# Altium schematic sheet LO.SchDoc
size A4
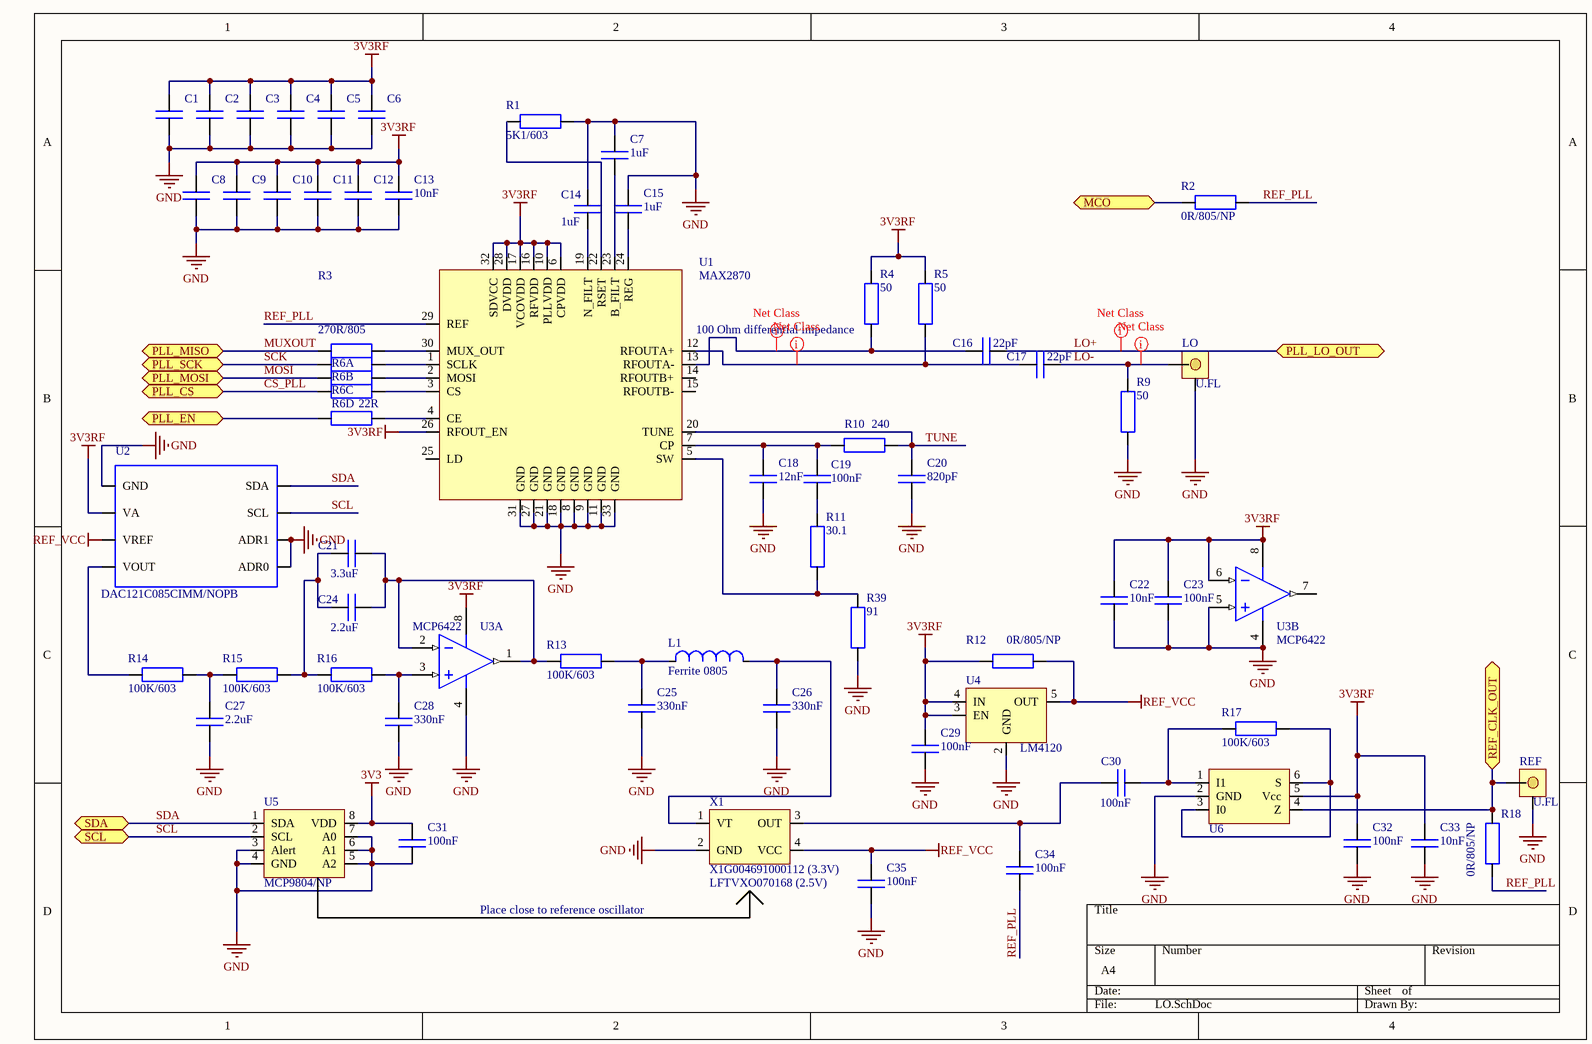
[diagram p0: LO.SchDoc]

## Parts
C1  100nF  [smd C0603_0.80]  (value not drawn)
C2  100nF  [smd C0603_0.80]  (value not drawn)
C3  100nF  [smd C0603_0.80]  (value not drawn)
C4  100nF  [smd C0603_0.80]  (value not drawn)
C5  100nF  [smd C0603_0.80]  (value not drawn)
C6  100nF  [smd C0603_0.80]  (value not drawn)
C7  1uF  [smd C0603_0.80]
C8  10nF  [smd C0402]  (value not drawn)
C9  10nF  [smd C0402]  (value not drawn)
C10  10nF  [smd C0402]  (value not drawn)
C11  10nF  [smd C0402]  (value not drawn)
C12  10nF  [smd C0402]  (value not drawn)
C13  10nF  [smd C0402]
C14  1uF  [smd C0603_0.80]
C15  1uF  [smd C0603_0.80]
C16  22pF  [smd C0402]
C17  22pF  [smd C0402]
C18  12nF  [smd C0603_0.80]
C19  100nF  [smd C0603_0.80]
C20  820pF  [smd C0603_0.80]
C21  3.3uF  [smd C0805_1.30]
C22  10nF  [smd C0402]
C23  100nF  [smd C0603_0.80]
C24  2.2uF  [smd C0805_1.30]
C25  330nF  [smd C0805_0.60]
C26  330nF  [smd C0805_0.60]
C27  2.2uF  [smd C0805_1.30]
C28  330nF  [smd C0805_0.60]
C29  100nF  [smd C0603_0.80]
C30  100nF  [smd C0603_0.80]
C31  100nF  [smd C0603_0.80]
C32  100nF  [smd C0603_0.80]
C33  10nF  [smd C0603_0.80]
C34  100nF  [smd C0603_0.80]
C35  100nF  [smd C0603_0.80]
L1  Ferrite 0805  [smd C0805]
LO  U.FL  [smd U.FL]
R1  5K1/603  [smd C0603_0.45]
R2  0R/805/NP  [smd C0805_0.50]
R3  270R/805  [smd C0805_0.50]
R4  50  [smd C0402_0.35]
R5  50  [smd C0402_0.35]
R6  22R  [smd R EXB38v]  (value not drawn)  (parts A,B,C,D of 4)
R9  50  [smd C0402_0.35]
R10  240  [smd C0603_0.45]
R11  30.1  [smd C0603_0.45]
R12  0R/805/NP  [smd C0805_0.50]
R13  100K/603  [smd C0603_0.45]
R14  100K/603  [smd C0603_0.45]
R15  100K/603  [smd C0603_0.45]
R16  100K/603  [smd C0603_0.45]
R17  100K/603  [smd C0603_0.45]
R18  0R/805/NP  [smd C0805_0.50]
R39  91  [smd C0603_0.45]
REF  U.FL  [smd U.FL]
U1  MAX2870  [MAXIM-T3255]
U2  DAC121C085CIMM/NOPB  [smd MSOP/8]
U3  MCP6422  [smd soicn/8]  (parts A,B of 2)
U4  LM4120  [SO23-5 TI]
U5  MCP9804/NP  [smd MSOP/8]
U6  NC7WZU04  [SMD SC-70 (6-pin)]  (value not drawn)
X1  X1G004691000112 (3.3V)  [X1G004691000112]

## Ports
MCO, PLL_CS, PLL_EN, PLL_LO_OUT, PLL_MISO, PLL_MOSI, PLL_SCK, REF_CLK_OUT, SCL, SDA

## Nets
3V3: C31.2 U5.8(VDD)
3V3RF: C1.2 C2.2 C3.2 C4.2 C5.2 C6.2 C8.2 C9.2 C10.2 C11.2 C12.2 C13.2 C22.2 C23.2 C29.2 C32.2 C33.2 R4.2 R5.2 R12.1 U1.6(CPVDD) U1.10(PLLVDD) U1.16(RFVDD) U1.17(VCOVDD) U1.26(RFOUT_EN) U1.28(DVDD) U1.32(SDVCC) U2.6(VA) U3.6(IN-) U3.8(V+) U4.3(EN) U4.4(IN) U6.5(Vcc)
GND: C1.1 C2.1 C3.1 C4.1 C5.1 C6.1 C7.1 C8.1 C9.1 C10.1 C11.1 C12.1 C13.1 C14.1 C15.1 C18.1 C20.1 C22.1 C23.1 C25.1 C26.1 C27.1 C28.1 C29.1 C31.1 C32.1 C33.1 C35.1 LO.0 R1.1 R9.1 R39.1 REF.0 U1.8(GND) U1.9(GND) U1.11(GND) U1.18(GND) U1.21(GND) U1.27(GND) U1.31(GND) U1.33(GND) U2.1(ADR0) U2.2(ADR1) U2.5(GND) U3.4(V-) U3.5(IN+) U4.2(GND) U5.3(Alert) U5.4(GND) U5.5(A2) U5.6(A1) U5.7(A0) U6.2(GND) X1.2(GND)
REF_VCC: C35.2 R12.2 U2.7(VREF) U4.5(OUT) X1.4(VCC)
CS_PLL: R6.5 ; port PLL_CS
LO+: C16.2 ; port PLL_LO_OUT
LO-: C17.2 LO.1 R9.2
MCO: R2.2 ; port MCO
MOSI: R6.3 ; port PLL_MOSI
MUXOUT: R3.1 ; port PLL_MISO
PLL_EN: R6.7 ; port PLL_EN
REF_CLK_OUT: R18.2 REF.1 U6.4(Z) ; port REF_CLK_OUT
REF_PLL: C34.2 R2.1 R18.1 U1.29(REF)
SCK: R6.1 ; port PLL_SCK
SCL: U2.3(SCL) U5.2(SCL) ; port SCL
SDA: U2.4(SDA) U5.1(SDA) ; port SDA
TUNE: C20.2 R10.2 U1.20(TUNE)
NetC7_2: C7.2 U1.23(B_FILT)
NetC14_2: C14.2 U1.19(N_FILT)
NetC15_2: C15.2 U1.24(REG)
NetC16_1: C16.1 R4.1 U1.13(RFOUTA-)
NetC17_1: C17.1 R5.1 U1.12(RFOUTA+)
NetC18_2: C18.2 C19.2 R10.1 U1.7(CP)
NetC19_1: C19.1 R11.2
NetC21_1: C21.1 C24.1 R13.1 U3.1(OUT) U3.2(IN-)
NetC21_2: C21.2 C24.2 R15.2 R16.1
NetC25_2: C25.2 L1.1 R13.2
NetC26_2: C26.2 L1.2 X1.1(VT)
NetC27_2: C27.2 R14.2 R15.1
NetC28_2: C28.2 R16.2 U3.3(IN+)
NetC30_1: C30.1 R17.1 U6.1(I1)
NetC30_2: C30.2 C34.1 X1.3(OUT)
NetR1_2: R1.2 U1.22(RSET)
NetR3_2: R3.2 U1.30(MUX_OUT)
NetR6_2: R6.2 U1.1(SCLK)
NetR6_4: R6.4 U1.2(MOSI)
NetR6_6: R6.6 U1.3(CS)
NetR6_8: R6.8 U1.4(CE)
NetR11_1: R11.1 R39.2 U1.5(SW)
NetR14_1: R14.1 U2.8(VOUT)
NetR17_2: R17.2 U6.3(I0) U6.6(S)

Not connected (* = marked no-connect by the designer): U1 14(RFOUTB+) 15(RFOUTB-) 25(LD); U3 7(OUT)

## Layout directives
net class RF: LO+, LO-, NetC16_1, NetC17_1

## Notes on the sheet
- (near R4) 100 Ohm differential impedance
- Place close to reference oscillator
- (near X1) LFTVXO070168 (2.5V)

## Library data of the parts
C1-C6 C23 C29-C35 = CSMD603/100nF: smd capaciteit, verp.0603, 100nF; Part Number: CSMD603/100nF; Component Kind: Standard; Component Type: Standard; Designator: CSMD603/100nF; Pin Count: 2; Supplier 1: Farnell
C7 C14 C15 = CSMD603/1uF: smd capaciteit, verp.0603, 1uF; Part Number: CSMD603/18nF; Component Kind: Standard; Component Type: Standard; Designator: CSMD603/18nF; Library Reference: CSMD603/18nF; Pin Count: 2
C8-C13 C22 = CSMD402/100nF: smd capaciteit, verp.0402, 10nF; Part Number: CSMD402/100nF; Component Kind: Standard; Component Type: Standard; Designator: CSMD402/100nF; Pin Count: 2; Supplier 1: Farnell
C16 C17 = CSMD402/22pF: smd capaciteit, verp.0402, 22pF; Part Number: CSMD402/22pF; Component Kind: Standard; Component Type: Standard; Designator: CSMD402/22pF; Pin Count: 2; Supplier 1: Farnell
C18-C20 = CSMD603/12nF: smd capaciteit, verp.0603, 12nF; Part Number: CSMD603/12nF; Component Kind: Standard; Component Type: Standard; Designator: CSMD603/12nF; Pin Count: 2
C21 C24 C27 = CSMD805/1uF: smd capaciteit, verp.0805, 1uF
C25 C26 C28 = CSMD805/330nF: smd capaciteit, verp.0805, 330nF; Part Number: CSMD805/330nF; Component Kind: Standard; Component Type: Standard; Designator: CSMD805/330nF; Pin Count: 2
L1 = Ferrite 0805: Ferrite bead, 0805 package; Supplier 1: Farnell
LO REF = CON HRS/SMA/ U.FL-R-SMT(01): connector Hirose, U.FL serie, U.FL-R-SMT(01); Supplier 1: Farnell
R1 = 5K1/603: weerstand SMD603, 5K1
R2 R3 R12 R18 = 270R/805: weerstand SMD805, 270R
R4 R5 R9 = 47K/402: weerstand SMD402, 47K
R6 = 22R/Network4/603: weerstandsnetwerk SMD603, 4x 22R; Supplier 1: Farnell
R10 R11 R39 = 240K/603: weerstand SMD603, 240K
R13-R17 = 100K/603: weerstand SMD603, 100K; Supplier 1: Farnell
U2 = DAC081C085CIMM/NOPB: 12-Bit Micro Power DAC with I2C interface; Supplier 1: Farnell
U3 = MCP602-E/SN: Dual 2.7V to 6.0V Single Supply CMOS Op Amp
U5 = MCP9804: ±0.25°C Typical Accuracy Digital Temperature Sensor; Supplier 1: Farnell
U6 = NC7SV157P6X: TinyLogic  2-Input Non-Inverting Multiplexer
X1 = X1G004691000112